# Altium project Breakout_board_6-SON.PrjPcb
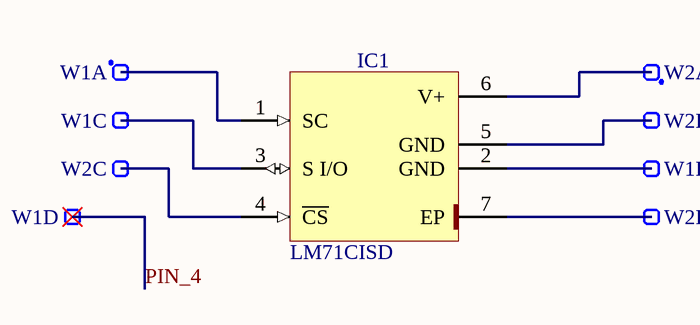
[diagram p0: 6-SON.SchDoc]
1 sheet, 3 parts. Net scope: global (net labels, ports and power ports of the same name join across sheets).
Board file: 6-SON.PcbDoc

## Sheet 6-SON.SchDoc
size A4

### Parts
IC1  LM71CISD  [SON95P300X300X80-7N-R160X210-NGG0006A]
W1  Header 4  [SAMTEC_TSW-104-23-L-S]  (value not drawn)  (parts A,B,C,D of 4)
W2  Header 4  [SAMTEC_TSW-104-23-L-S]  (value not drawn)  (parts A,B,C,D of 4)

### Nets
PIN_4: W1.4
NetIC1_1: IC1.1(SC) W1.1
NetIC1_2: IC1.2(GND) W1.2
NetIC1_3: IC1.3(S_I/O) W1.3
NetIC1_4: IC1.4(~{CS}) W2.3
NetIC1_5: IC1.5(GND) W2.2
NetIC1_6: IC1.6(V+) W2.1
NetIC1_7: IC1.7(EP) W2.4

### Library data of the parts
IC1 = LM71CISD: LM71/LM71-Q1 SPI/MICROWIRE 13-Bit Plus Sign Temperature Sensor; Manufacturer: TEXAS INSTRUMENTS; PressFit: No; Component Kind: Standard; Component Type: Standard; Manufacturer Part Number: LM71CISD; Device: LM71CISD; Part Number: LM71CISD; PackageDescription: SON, 0.95mm Pitch; 6 Pin, 3.00mm W X 3mm L X 0.80mm H body (w/Thermal Tab 1.6mm x 2.1mm); Part Description: LM71/LM71-Q1 SPI/MICROWIRE 13-Bit Plus Sign Temperature Sensor; Pin Count: 6; Mounted: Yes; Socket: No; SMD: Yes; ComponentHeight: 0.8mm; Author: LNLS DIG LOS; CreateDate: 10/07/2017; LatestRevisionDate: 10/07/2017
W1 W2 = SAMTEC_TSW-104-23-L-S: 4 Mini Wire-Wrap Contact Strip Header; Part Description: 4 Contacts - Pitch 2.54mm - Single Row  Through Mount Straight Header (Post Lead 5.84mm, Tail Lead 2.92mm, Insulator 2.54mm); Manufacturer: SAMTEC; PressFit: No; Part Number: SAMTEC_TSW-104-23-L-S; Component Kind: Standard; Component Type: Standard; Pin Count: 4; Family: Header 4; Mounted: Yes; Socket: No; Sense: No; SMD: No; Status: None; Manufacturer Part Number: TSW-104-23-L-S; ComponentHeight: 8.38mm; HelpURL: \\cern.ch\dfs\Applications\Altium\Datasheets\SAMTEC_TSW-104-23-L-S.pdf; Author: CERN DEM JLC; CreateDate: 10/10/2012; LatestRevisionDate: 10/10/2012